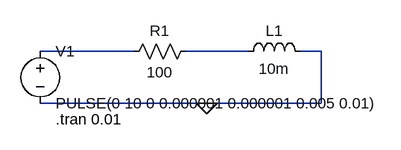
[diagram p0: schematic RL_Circuit.asc]
RL_Circuit.asc, the LTspice schematic file:
Version 4.1
SHEET 1 880 680
WIRE 80 112 -64 112
WIRE 256 112 160 112
WIRE 368 112 336 112
WIRE 192 192 -64 192
WIRE 368 192 368 112
WIRE 368 192 192 192
FLAG 192 192 0
SYMBOL ind 240 128 R270
WINDOW 0 32 56 VTop 2
WINDOW 3 5 56 VBottom 2
SYMATTR InstName L1
SYMATTR Value 10m
SYMBOL res 176 96 R90
WINDOW 0 0 56 VBottom 2
WINDOW 3 32 56 VTop 2
SYMATTR InstName R1
SYMATTR Value 100
SYMBOL voltage -64 96 R0
WINDOW 123 0 0 Left 0
WINDOW 39 0 0 Left 0
SYMATTR InstName V1
SYMATTR Value PULSE(0 10 0 0.000001 0.000001 0.005 0.01)
TEXT -40 216 Left 2 !.tran 0.01

The netlist it stands for:
* RL_Circuit.asc
L1 N002 0 10m
R1 N002 N001 100
V1 N001 0 PULSE(0 10 0 0.000001 0.000001 0.005 0.01)
.tran 0.01
.backanno
.end